# Altium project 50ohm-diff_converter.PrjPcb (part 1 of 2)
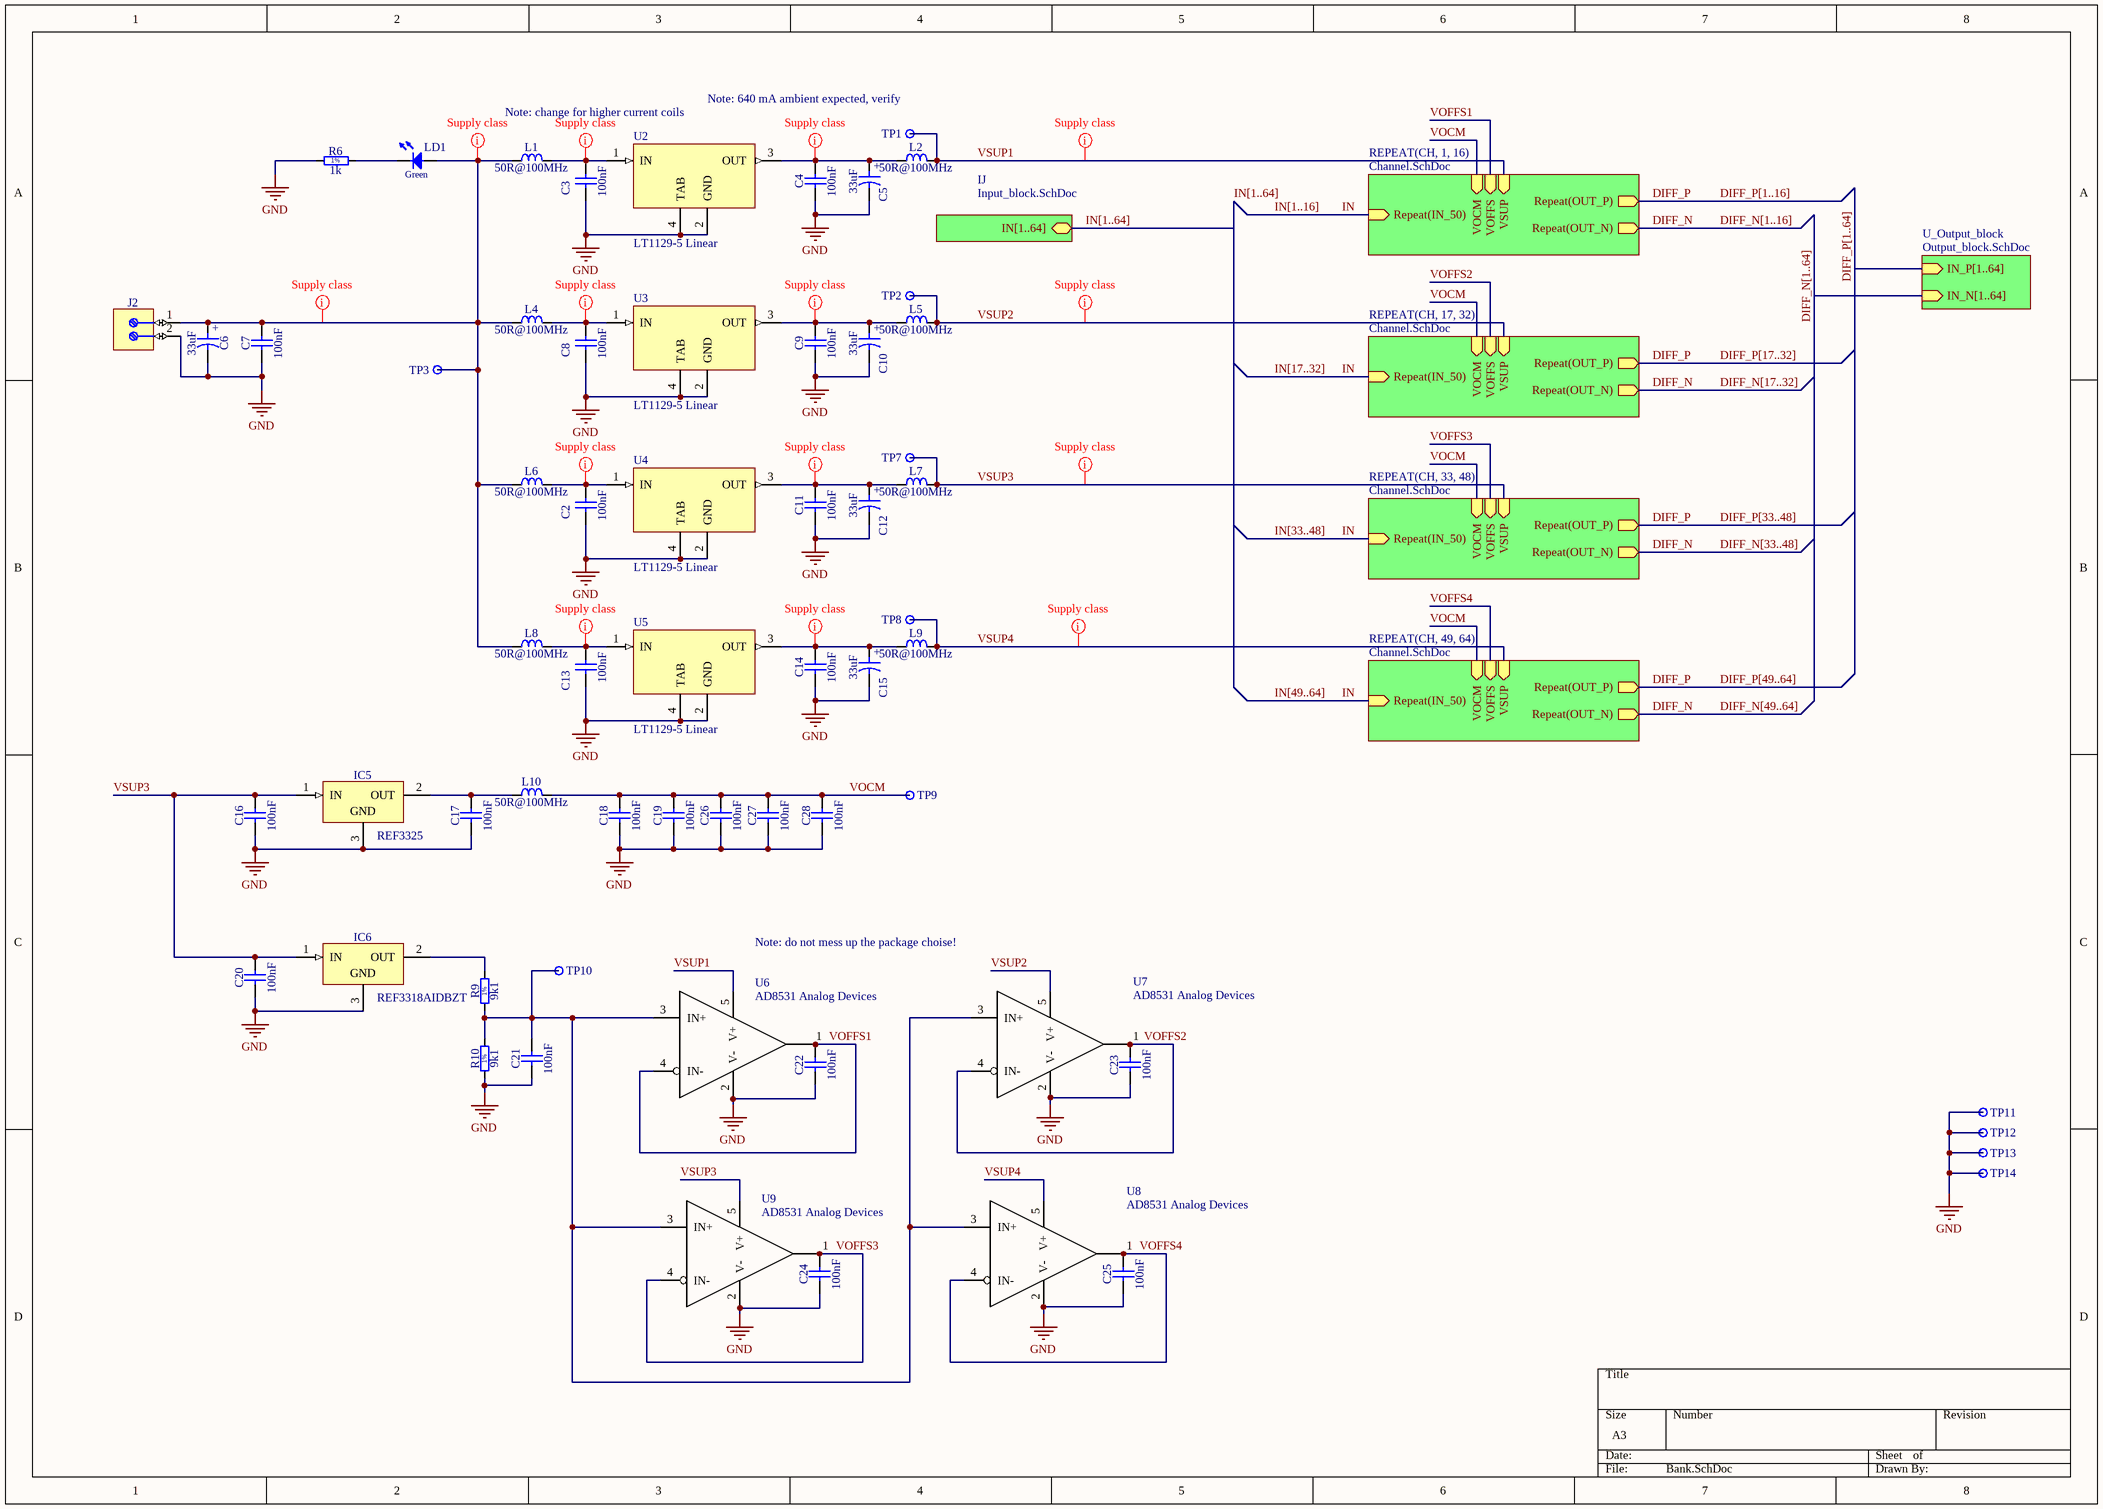
[diagram p0: Bank.SchDoc]
4 sheets, 769 parts. Net scope: hierarchical (ports join the sheet entries above them; power ports are global).
Board file: PCB.PcbDoc
Sheets:
  Bank.SchDoc
    CH1 = Channel.SchDoc
    CH2 = Channel.SchDoc
    CH3 = Channel.SchDoc
    CH4 = Channel.SchDoc
    CH5 = Channel.SchDoc
    CH6 = Channel.SchDoc
    CH7 = Channel.SchDoc
    CH8 = Channel.SchDoc
    CH9 = Channel.SchDoc
    CH10 = Channel.SchDoc
    CH11 = Channel.SchDoc
    CH12 = Channel.SchDoc
    CH13 = Channel.SchDoc
    CH14 = Channel.SchDoc
    CH15 = Channel.SchDoc
    CH16 = Channel.SchDoc
    IJ = Input_block.SchDoc
    CH17 = Channel.SchDoc
    CH18 = Channel.SchDoc
    CH19 = Channel.SchDoc
    CH20 = Channel.SchDoc
    CH21 = Channel.SchDoc
    CH22 = Channel.SchDoc
    CH23 = Channel.SchDoc
    CH24 = Channel.SchDoc
    CH25 = Channel.SchDoc
    CH26 = Channel.SchDoc
    CH27 = Channel.SchDoc
    CH28 = Channel.SchDoc
    CH29 = Channel.SchDoc
    CH30 = Channel.SchDoc
    CH31 = Channel.SchDoc
    CH32 = Channel.SchDoc
    U_Output_block = Output_block.SchDoc
    CH33 = Channel.SchDoc
    CH34 = Channel.SchDoc
    CH35 = Channel.SchDoc
    CH36 = Channel.SchDoc
    CH37 = Channel.SchDoc
    CH38 = Channel.SchDoc
    CH39 = Channel.SchDoc
    CH40 = Channel.SchDoc
    CH41 = Channel.SchDoc
    CH42 = Channel.SchDoc
    CH43 = Channel.SchDoc
    CH44 = Channel.SchDoc
    CH45 = Channel.SchDoc
    CH46 = Channel.SchDoc
    CH47 = Channel.SchDoc
    CH48 = Channel.SchDoc
    CH49 = Channel.SchDoc
    CH50 = Channel.SchDoc
    CH51 = Channel.SchDoc
    CH52 = Channel.SchDoc
    CH53 = Channel.SchDoc
    CH54 = Channel.SchDoc
    CH55 = Channel.SchDoc
    CH56 = Channel.SchDoc
    CH57 = Channel.SchDoc
    CH58 = Channel.SchDoc
    CH59 = Channel.SchDoc
    CH60 = Channel.SchDoc
    CH61 = Channel.SchDoc
    CH62 = Channel.SchDoc
    CH63 = Channel.SchDoc
    CH64 = Channel.SchDoc

## Sheet Bank.SchDoc
size A3

### Parts
C2  100nF  [CAPC2012X135N]
C3  100nF  [CAPC2012X135N]
C4  100nF  [CAPC2012X135N]
C5  33uF  [CAPAE660X540N]
C6  33uF  [CAPAE660X540N]
C7  100nF  [CAPC2012X135N]
C8  100nF  [CAPC2012X135N]
C9  100nF  [CAPC2012X135N]
C10  33uF  [CAPAE660X540N]
C11  100nF  [CAPC2012X135N]
C12  33uF  [CAPAE660X540N]
C13  100nF  [CAPC2012X135N]
C14  100nF  [CAPC2012X135N]
C15  33uF  [CAPAE660X540N]
C16  100nF  [CAPC2012X135N]
C17  100nF  [CAPC2012X135N]
C18  100nF  [CAPC2012X135N]
C19  100nF  [CAPC2012X135N]
C20  100nF  [CAPC2012X135N]
C21  100nF  [CAPC2012X135N]
C22  100nF  [CAPC2012X135N]
C23  100nF  [CAPC2012X135N]
C24  100nF  [CAPC2012X135N]
C25  100nF  [CAPC2012X135N]
C26  100nF  [CAPC2012X135N]
C27  100nF  [CAPC2012X135N]
C28  100nF  [CAPC2012X135N]
IC5  REF3325  [SOT95P237X112-3N]
IC6  REF3318AIDBZT  [SOT95P237X112-3N]
J2  Terminal  [WIELAND_25.161.0253.0]  (value not drawn)
L1  50R@100MHz  [IND_MURATA_BLM31PG]
L2  50R@100MHz  [IND_MURATA_BLM31PG]
L4  50R@100MHz  [IND_MURATA_BLM31PG]
L5  50R@100MHz  [IND_MURATA_BLM31PG]
L6  50R@100MHz  [IND_MURATA_BLM31PG]
L7  50R@100MHz  [IND_MURATA_BLM31PG]
L8  50R@100MHz  [IND_MURATA_BLM31PG]
L9  50R@100MHz  [IND_MURATA_BLM31PG]
L10  50R@100MHz  [IND_MURATA_BLM31PG]
LD1  Green  [LED_OSRAM_LGR971]  (value not drawn)
R6  1k  [RESC2012X60N]
R9  9k1  [RESC2012X60N]
R10  9k1  [RESC2012X60N]
TP1  Test Point  [VERO_20-313145]  (value not drawn)
TP2  Test Point  [VERO_20-313145]  (value not drawn)
TP3  Test Point  [VERO_20-313145]  (value not drawn)
TP7  Test Point  [VERO_20-313145]  (value not drawn)
TP8  Test Point  [VERO_20-313145]  (value not drawn)
TP9  Test Point  [VERO_20-313145]  (value not drawn)
TP10  Test Point  [VERO_20-313145]  (value not drawn)
TP11  Test Point  [VERO_20-313145]  (value not drawn)
TP12  Test Point  [VERO_20-313145]  (value not drawn)
TP13  Test Point  [VERO_20-313145]  (value not drawn)
TP14  Test Point  [VERO_20-313145]  (value not drawn)
U2  LT1129-5 Linear  [SOT230P700X175-4N]
U3  LT1129-5 Linear  [SOT230P700X175-4N]
U4  LT1129-5 Linear  [SOT230P700X175-4N]
U5  LT1129-5 Linear  [SOT230P700X175-4N]
U6  AD8531 Analog Devices  [SOT95P285X145-5N]
U7  AD8531 Analog Devices  [SOT95P285X145-5N]
U8  AD8531 Analog Devices  [SOT95P285X145-5N]
U9  AD8531 Analog Devices  [SOT95P285X145-5N]

### Sub-sheets
IJ = Input_block.SchDoc: IN[1..64] (bidir)
REPEAT(CH, 1, 16) = Channel.SchDoc: Repeat(OUT_N) (out), Repeat(OUT_P) (out), VSUP (in), Repeat(IN_50) (in), VOFFS (in), VOCM (in)
REPEAT(CH, 17, 32) = Channel.SchDoc: Repeat(OUT_N) (out), Repeat(OUT_P) (out), VSUP (in), Repeat(IN_50) (in), VOCM (in), VOFFS (in)
REPEAT(CH, 33, 48) = Channel.SchDoc: Repeat(OUT_N) (out), Repeat(OUT_P) (out), VSUP (in), Repeat(IN_50) (in), VOCM (in), VOFFS (in)
REPEAT(CH, 49, 64) = Channel.SchDoc: Repeat(OUT_N) (out), Repeat(OUT_P) (out), VSUP (in), Repeat(IN_50) (in), VOCM (in), VOFFS (in)
U_Output_block = Output_block.SchDoc: IN_P[1..64] (in), IN_N[1..64] (in)

### Nets
GND: C2.1 C3.1 C4.1 C5.2 C6.2 C7.1 C8.1 C9.1 C10.2 C11.1 C12.2 C13.1 C14.1 C15.2 C16.1 C17.1 C18.1 C19.1 C20.1 C21.1 C22.1 C23.1 C24.1 C25.1 C26.1 C27.1 C28.1 IC5.3(GND) IC6.3(GND) J2.2 R6.1 R10.1 TP11.1 TP12.1 TP13.1 TP14.1 U2.2(GND) U2.4(TAB) U3.2(GND) U3.4(TAB) U4.2(GND) U4.4(TAB) U5.2(GND) U5.4(TAB) U6.2(V-) U7.2(V-) U8.2(V-) U9.2(V-)
DIFF_N: sheet REPEAT(CH, 1, 16)/Repeat(OUT_N), sheet REPEAT(CH, 17, 32)/Repeat(OUT_N), sheet REPEAT(CH, 33, 48)/Repeat(OUT_N), sheet REPEAT(CH, 49, 64)/Repeat(OUT_N)
DIFF_P: sheet REPEAT(CH, 1, 16)/Repeat(OUT_P), sheet REPEAT(CH, 17, 32)/Repeat(OUT_P), sheet REPEAT(CH, 33, 48)/Repeat(OUT_P), sheet REPEAT(CH, 49, 64)/Repeat(OUT_P)
IN: sheet REPEAT(CH, 1, 16)/Repeat(IN_50), sheet REPEAT(CH, 17, 32)/Repeat(IN_50), sheet REPEAT(CH, 33, 48)/Repeat(IN_50), sheet REPEAT(CH, 49, 64)/Repeat(IN_50)
VOCM: C18.2 C19.2 C26.2 C27.2 C28.2 L10.2 TP9.1 ; sheet REPEAT(CH, 1, 16)/VOCM, sheet REPEAT(CH, 17, 32)/VOCM, sheet REPEAT(CH, 33, 48)/VOCM, sheet REPEAT(CH, 49, 64)/VOCM
VOFFS1: C22.2 U6.1(OUT+) U6.4(IN-) ; sheet REPEAT(CH, 1, 16)/VOFFS
VOFFS2: C23.2 U7.1(OUT+) U7.4(IN-) ; sheet REPEAT(CH, 17, 32)/VOFFS
VOFFS3: C24.2 U9.1(OUT+) U9.4(IN-) ; sheet REPEAT(CH, 33, 48)/VOFFS
VOFFS4: C25.2 U8.1(OUT+) U8.4(IN-) ; sheet REPEAT(CH, 49, 64)/VOFFS
VSUP1: L2.2 TP1.1 U6.5(V+) ; sheet REPEAT(CH, 1, 16)/VSUP
VSUP2: L5.2 TP2.1 U7.5(V+) ; sheet REPEAT(CH, 17, 32)/VSUP
VSUP3: C16.2 C20.2 IC5.1(IN) IC6.1(IN) L7.2 TP7.1 U9.5(V+) ; sheet REPEAT(CH, 33, 48)/VSUP
VSUP4: L9.2 TP8.1 U8.5(V+) ; sheet REPEAT(CH, 49, 64)/VSUP
NetC2_2: C2.2 L6.2 U4.1(IN)
NetC3_2: C3.2 L1.2 U2.1(IN)
NetC4_2: C4.2 C5.1 L2.1 U2.3(OUT)
NetC6_1: C6.1 C7.2 J2.1 L1.1 L4.1 L6.1 L8.1 LD1.2(A) TP3.1
NetC8_2: C8.2 L4.2 U3.1(IN)
NetC9_2: C9.2 C10.1 L5.1 U3.3(OUT)
NetC11_2: C11.2 C12.1 L7.1 U4.3(OUT)
NetC13_2: C13.2 L8.2 U5.1(IN)
NetC14_2: C14.2 C15.1 L9.1 U5.3(OUT)
NetC17_2: C17.2 IC5.2(OUT) L10.1
NetC21_2: C21.2 R9.1 R10.2 TP10.1 U6.3(IN+) U7.3(IN+) U8.3(IN+) U9.3(IN+)
NetIC6_2: IC6.2(OUT) R9.2
NetLD1_1: LD1.1(C) R6.2

### Buses and harness runs
bus DIFF_N[1..16]
bus DIFF_N[1..64] = sheet U_Output_block/IN_N[1..64]
bus DIFF_N[17..32]
bus DIFF_N[33..48]
bus DIFF_N[49..64]
bus DIFF_P[1..16]
bus DIFF_P[1..64] = sheet U_Output_block/IN_P[1..64]
bus DIFF_P[17..32]
bus DIFF_P[33..48]
bus DIFF_P[49..64]
bus IN[1..16]
bus IN[1..64] = sheet IJ/IN[1..64]
bus IN[17..32]
bus IN[33..48]
bus IN[49..64]

### Layout directives
net class Supply: NetC2_2, NetC3_2, NetC4_2, NetC6_1, NetC8_2, NetC9_2, NetC11_2, NetC13_2, NetC14_2, VSUP1, VSUP2, VSUP3, VSUP4

### Notes on the sheet
- (near TP1) Note: 640 mA ambient expected, verify
- Note: change for higher current coils
- Note: do not mess up the package choise!
- (in symbol CAE660-540_33UF_25V_20%) +
- (in symbol R0805_1K_1%_0.125W_100PPM) 1%
- (in symbol R0805_9K1_1%_0.125W_100PPM) 1%

### Library data of the parts
C2-C4 C7-C9 C11 C13 C14 C16-C28 = CC0805_100NF_50V_10%_X7R: Non-polarised capacitor; Part Description: SMD Multilayer Chip Ceramic Capacitor; Manufacturer: GENERIC; Manufacturer1 Part Number: C2012X7R1H104K085AA; Voltage: 50V; TC: X7R; Tolerance: ±10%; Part Number: CC0805_100NF_50V_10%_X7R; Component Kind: Standard; Component Type: Standard; Pin Count: 2; Value: 100nF; Status: Preferred; Manufacturer Part Number: CC0805_100NF_50V_10%_X7R; Case: 0805; Mounted: Yes; Socket: No; SMD: Yes; Sense: No; Manufacturer1 Example: TDK; Manufacturer1 ComponentHeight: 1mm; HelpURL: \\cern.ch\dfs\Applications\Altium\Datasheets\CC0805_X7R_TDK_C.pdf; Author: CERN DEM JLC; CreateDate: 03.12.2007; LatestRevisionDate: 22.04.2015
C5 C6 C10 C12 C15 = CAE660-540_33UF_25V_20%: Polarised capacitor; Part Description: Aluminum Electrolytic SMT Capacitor; Manufacturer: PANASONIC; Manufacturer Part Number: EEEFK1E330AP; Voltage: 25V; Tolerance: ±20%; Part Number: CAE660-540_33UF_25V_20%; Component Kind: Standard; Component Type: Standard; Pin Count: 2; Value: 33uF; Status: Not Recommended; Case: D; Mounted: Yes; Socket: No; SMD: Yes; Sense: No; ComponentHeight: 5.8mm; HelpURL: \\cern.ch\dfs\Applications\Altium\Datasheets\CAE_PANASONIC_FK.pdf; Author: CERN DEM JLC; CreateDate: 03.12.2007; LatestRevisionDate: 05.11.2014
IC5 IC6 = REF3318AIDBZT: 3-Terminal Regulator 1=IN 2=OUT 3=GND; Part Description: 1.8V, 30ppm/°C Drift, 3.9uA, Voltage Reference; Manufacturer: TEXAS INSTRUMENTS; PressFit: No; Bonding: No; Component Kind: Standard; Component Type: Standard; PackageDescription: SOT, 0.95mm, pitch; 3 pin,1.30mm W X 2.92mm L X 1.12mm H body, IPC Medium Density; Pin Count: 3; Case: SOT23; Mounted: Yes; Socket: No; SMD: Yes; Sense: No; ComponentHeight: 1.12mm; HelpURL: \\cern.ch\dfs\Applications\Altium\Datasheets\REF3318AIDBZT.pdf; Author: CERN DEM JLC; CreateDate: 20.06.2011; LatestRevisionDate: 20.06.2011
  IC5: Part Number: REF3325; Device: REF3325; Manufacturer Part Number: REF3325
  IC6: Part Number: REF3318AIDBZT; Device: REF3318AIDBZT; Manufacturer Part Number: REF3318AIDBZT
J2 = WIELAND_25.161.0253.0: Terminal Block, 2 Positions, Screw Connection; Part Description: 16A 250VAC 2 Way PCB Terminal Block, Pitch 5mm, Screw Connection, Wire Size Max: 2.5mm²; PressFit: No; Part Number: WIELAND_25.161.0253.0; Component Kind: Standard; Component Type: Standard; Pin Count: 3; Family: Terminal; Mounted: Yes; Socket: No; SMD: No; Sense: No; Status: None; Manufacturer: WIELAND; Manufacturer Part Number: 25.161.0253.0; ComponentHeight: 15mm; HelpURL: \\cern.ch\dfs\Applications\Altium\Datasheets\WIELAND_25.161.0253.0.pdf; Author: CERN DEM JLC; CreateDate: 03.06.2009; LatestRevisionDate: 03.06.2009
L1 L2 L4-L10 = IND1206_MURATA_BLM31PG500SN1: Inductor; Part Description: SMD EMIFIL Chip Ferrite Bead; Manufacturer: MURATA; Power: 3.5A; Resistance: 0.015R; Part Number: IND1206_MURATA_BLM31PG500SN1; Component Kind: Standard; Component Type: Standard; Pin Count: 2; Value: 50R@100MHz; Status: None; Manufacturer Part Number: BLM31PG500SN1; Case: 1206; Mounted: Yes; Socket: No; SMD: Yes; Sense: No; ComponentHeight: 1.3mm; HelpURL: \\cern.ch\dfs\Applications\Altium\Datasheets\IND1206_MURATA_BLM31P.pdf; Author: CERN DEM JLC; CreateDate: 05.12.2013; LatestRevisionDate: 05.12.2013
LD1 = LED_OSRAM_LGR971: LED Green 1C 2A; Part Description: Surface Mount Green LED (0805 Case); Manufacturer: OSRAM; Manufacturer Part Number: LGR971; PressFit: No; Bonding: No; Part Number: LED_OSRAM_LGR971; Component Kind: Standard; Component Type: Standard; Color: Green; PackageDescription: Green Chip LED, 2-Leads, Body 2.0x1.25mm, IPC Medium Density; Pin Count: 2; Case: 0805; Mounted: Yes; Socket: No; SMD: Yes; Sense: No; ComponentHeight: 0.9mm; HelpURL: \\cern.ch\dfs\Applications\Altium\Datasheets\LED_OSRAM_LGR971.pdf; Author: CERN DEM JLC; CreateDate: 28.01.2009; LatestRevisionDate: 17.03.2010
R6 = R0805_1K_1%_0.125W_100PPM: Resistor - 1%; Part Description: General Purpose Thick Film Chip Resistor; Manufacturer: GENERIC; Manufacturer1 Part Number: NRC10F1001TRF; Power: 0.125W; TC: ±100ppm/°C; PressFit: No; Part Number: R0805_1K_1%_0.125W_100PPM; Component Kind: Standard; Component Type: Standard; Pin Count: 2; Value: 1k; Status: Preferred; Tolerance: ±1%; Manufacturer Part Number: R0805_1K_1%_0.125W_100PPM; Case: 0805; Mounted: Yes; Sense: No; Socket: No; SMD: Yes; Manufacturer1 Example: NIC COMPONENT; Manufacturer1 ComponentHeight: 0.6mm; HelpURL: \\cern.ch\dfs\Applications\Altium\Datasheets\R0805_NIC_NRC.pdf; Author: CERN DEM JLC; CreateDate: 03.12.2007; LatestRevisionDate: 13.03.2008
R9 R10 = R0805_9K1_1%_0.125W_100PPM: Resistor - 1%; Part Description: General Purpose Thick Film Chip Resistor; Manufacturer: GENERIC; Manufacturer1 Part Number: NRC10F9101TRF; Power: 0.125W; TC: ±100ppm/°C; PressFit: No; Part Number: R0805_9K1_1%_0.125W_100PPM; Component Kind: Standard; Component Type: Standard; Pin Count: 2; Value: 9k1; Status: Preferred; Tolerance: ±1%; Manufacturer Part Number: R0805_9K1_1%_0.125W_100PPM; Case: 0805; Mounted: Yes; Sense: No; Socket: No; SMD: Yes; Manufacturer1 Example: NIC COMPONENT; Manufacturer1 ComponentHeight: 0.6mm; HelpURL: \\cern.ch\dfs\Applications\Altium\Datasheets\R0805_NIC_NRC.pdf; Author: CERN DEM JLC; CreateDate: 03.12.2007; LatestRevisionDate: 13.03.2008
TP1-TP3 TP7-TP14 = VERO_20-313145: Part Description: Black Bead PCB Terminal Test Pin for 2.4mm PCB Thickness (1.32mm Hole); Manufacturer: VERO TECHNOLOGIES; PressFit: No; Part Number: VERO_20-313145; Component Kind: Standard; Component Type: Standard; Pin Count: 1; Family: Test Point; Mounted: Yes; Socket: No; SMD: No; Sense: No; Status: None; Manufacturer Part Number: 20-313145; ComponentHeight: 5.3mm; HelpURL: \\cern.ch\dfs\Applications\Altium\Datasheets\VERO_20-313145.pdf; Author: CERN DEM JLC; CreateDate: 15.07.2013; LatestRevisionDate: 15.07.2013
U2-U5 = LT1129-5: Name: LT1129-5; Manufacturer: Linear
U6-U9 = AD8531: Manufacturer: Analog Devices; Name: AD8531

## Sheet Channel.SchDoc
size A4
Used 64 times, as channels CH1, CH2, CH3, CH4, CH5, CH6, CH7, CH8, CH9, CH10, CH11, CH12, CH13, CH14, CH15, CH16, CH17, CH18, CH19, CH20, CH21, CH22, CH23, CH24, CH25, CH26, CH27, CH28, CH29, CH30, CH31, CH32, CH33, CH34, CH35, CH36, CH37, CH38, CH39, CH40, CH41, CH42, CH43, CH44, CH45, CH46, CH47, CH48, CH49, CH50, CH51, CH52, CH53, CH54, CH55, CH56, CH57, CH58, CH59, CH60, CH61, CH62, CH63, CH64. Parts and nets are listed once, with the designators drawn on the sheet.
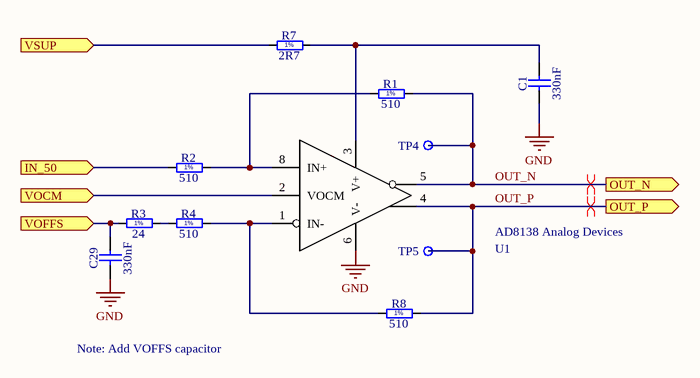
[diagram p1: Channel.SchDoc]

### Parts
C1  330nF  [CAPC2012X135N]
C29  330nF  [CAPC2012X135N]
R1  510  [RESC2012X60N]
R2  510  [RESC2012X60N]
R3  24  [RESC2012X60N]
R4  510  [RESC2012X60N]
R7  2R7  [RESC2012X60N]
R8  510  [RESC2012X60N]
TP4  Test Point  [Testpoint]  (value not drawn)
TP5  Test Point  [Testpoint]  (value not drawn)
U1  AD8138 Analog Devices  [SOIC127P600X175-8N]

### Ports
IN_50 (in), OUT_N (out), OUT_P (out), VOCM (in), VOFFS (in), VSUP (in)

### Nets
GND: C1.1 C29.1 U1.6(V-)
IN_50: R2.1 ; port IN_50
OUT_N: R1.2 TP4.1 U1.5(OUT-) ; port OUT_N
OUT_P: R8.2 TP5.1 U1.4(OUT+) ; port OUT_P
VOCM: U1.2(VOCM) ; port VOCM
VOFFS: C29.2 R3.1 ; port VOFFS
VSUP: R7.1 ; port VSUP
NetC1_2: C1.2 R7.2 U1.3(V+)
NetR1_1: R1.1 R2.2 U1.8(IN+)
NetR3_2: R3.2 R4.1
NetR4_2: R4.2 R8.1 U1.1(IN-)

### Channels
CH1: designators end in _CH1; ports IN_50=IN1 OUT_N=DIFF_N1 OUT_P=DIFF_P1 VOCM=VOCM VOFFS=VOFFS1 VSUP=VSUP1
CH2: designators end in _CH2; ports IN_50=IN2 OUT_N=DIFF_N2 OUT_P=DIFF_P2 VOCM=VOCM VOFFS=VOFFS1 VSUP=VSUP1
CH3: designators end in _CH3; ports IN_50=IN3 OUT_N=DIFF_N3 OUT_P=DIFF_P3 VOCM=VOCM VOFFS=VOFFS1 VSUP=VSUP1
CH4: designators end in _CH4; ports IN_50=IN4 OUT_N=DIFF_N4 OUT_P=DIFF_P4 VOCM=VOCM VOFFS=VOFFS1 VSUP=VSUP1
CH5: designators end in _CH5; ports IN_50=IN5 OUT_N=DIFF_N5 OUT_P=DIFF_P5 VOCM=VOCM VOFFS=VOFFS1 VSUP=VSUP1
CH6: designators end in _CH6; ports IN_50=IN6 OUT_N=DIFF_N6 OUT_P=DIFF_P6 VOCM=VOCM VOFFS=VOFFS1 VSUP=VSUP1
CH7: designators end in _CH7; ports IN_50=IN7 OUT_N=DIFF_N7 OUT_P=DIFF_P7 VOCM=VOCM VOFFS=VOFFS1 VSUP=VSUP1
CH8: designators end in _CH8; ports IN_50=IN8 OUT_N=DIFF_N8 OUT_P=DIFF_P8 VOCM=VOCM VOFFS=VOFFS1 VSUP=VSUP1
CH9: designators end in _CH9; ports IN_50=IN9 OUT_N=DIFF_N9 OUT_P=DIFF_P9 VOCM=VOCM VOFFS=VOFFS1 VSUP=VSUP1
CH10: designators end in _CH10; ports IN_50=IN10 OUT_N=DIFF_N10 OUT_P=DIFF_P10 VOCM=VOCM VOFFS=VOFFS1 VSUP=VSUP1
CH11: designators end in _CH11; ports IN_50=IN11 OUT_N=DIFF_N11 OUT_P=DIFF_P11 VOCM=VOCM VOFFS=VOFFS1 VSUP=VSUP1
CH12: designators end in _CH12; ports IN_50=IN12 OUT_N=DIFF_N12 OUT_P=DIFF_P12 VOCM=VOCM VOFFS=VOFFS1 VSUP=VSUP1
CH13: designators end in _CH13; ports IN_50=IN13 OUT_N=DIFF_N13 OUT_P=DIFF_P13 VOCM=VOCM VOFFS=VOFFS1 VSUP=VSUP1
CH14: designators end in _CH14; ports IN_50=IN14 OUT_N=DIFF_N14 OUT_P=DIFF_P14 VOCM=VOCM VOFFS=VOFFS1 VSUP=VSUP1
CH15: designators end in _CH15; ports IN_50=IN15 OUT_N=DIFF_N15 OUT_P=DIFF_P15 VOCM=VOCM VOFFS=VOFFS1 VSUP=VSUP1
CH16: designators end in _CH16; ports IN_50=IN16 OUT_N=DIFF_N16 OUT_P=DIFF_P16 VOCM=VOCM VOFFS=VOFFS1 VSUP=VSUP1
CH17: designators end in _CH17; ports IN_50=IN17 OUT_N=DIFF_N17 OUT_P=DIFF_P17 VOCM=VOCM VOFFS=VOFFS2 VSUP=VSUP2
CH18: designators end in _CH18; ports IN_50=IN18 OUT_N=DIFF_N18 OUT_P=DIFF_P18 VOCM=VOCM VOFFS=VOFFS2 VSUP=VSUP2
CH19: designators end in _CH19; ports IN_50=IN19 OUT_N=DIFF_N19 OUT_P=DIFF_P19 VOCM=VOCM VOFFS=VOFFS2 VSUP=VSUP2
CH20: designators end in _CH20; ports IN_50=IN20 OUT_N=DIFF_N20 OUT_P=DIFF_P20 VOCM=VOCM VOFFS=VOFFS2 VSUP=VSUP2
CH21: designators end in _CH21; ports IN_50=IN21 OUT_N=DIFF_N21 OUT_P=DIFF_P21 VOCM=VOCM VOFFS=VOFFS2 VSUP=VSUP2
CH22: designators end in _CH22; ports IN_50=IN22 OUT_N=DIFF_N22 OUT_P=DIFF_P22 VOCM=VOCM VOFFS=VOFFS2 VSUP=VSUP2
CH23: designators end in _CH23; ports IN_50=IN23 OUT_N=DIFF_N23 OUT_P=DIFF_P23 VOCM=VOCM VOFFS=VOFFS2 VSUP=VSUP2
CH24: designators end in _CH24; ports IN_50=IN24 OUT_N=DIFF_N24 OUT_P=DIFF_P24 VOCM=VOCM VOFFS=VOFFS2 VSUP=VSUP2
CH25: designators end in _CH25; ports IN_50=IN25 OUT_N=DIFF_N25 OUT_P=DIFF_P25 VOCM=VOCM VOFFS=VOFFS2 VSUP=VSUP2
CH26: designators end in _CH26; ports IN_50=IN26 OUT_N=DIFF_N26 OUT_P=DIFF_P26 VOCM=VOCM VOFFS=VOFFS2 VSUP=VSUP2
CH27: designators end in _CH27; ports IN_50=IN27 OUT_N=DIFF_N27 OUT_P=DIFF_P27 VOCM=VOCM VOFFS=VOFFS2 VSUP=VSUP2
CH28: designators end in _CH28; ports IN_50=IN28 OUT_N=DIFF_N28 OUT_P=DIFF_P28 VOCM=VOCM VOFFS=VOFFS2 VSUP=VSUP2
CH29: designators end in _CH29; ports IN_50=IN29 OUT_N=DIFF_N29 OUT_P=DIFF_P29 VOCM=VOCM VOFFS=VOFFS2 VSUP=VSUP2
CH30: designators end in _CH30; ports IN_50=IN30 OUT_N=DIFF_N30 OUT_P=DIFF_P30 VOCM=VOCM VOFFS=VOFFS2 VSUP=VSUP2
CH31: designators end in _CH31; ports IN_50=IN31 OUT_N=DIFF_N31 OUT_P=DIFF_P31 VOCM=VOCM VOFFS=VOFFS2 VSUP=VSUP2
CH32: designators end in _CH32; ports IN_50=IN32 OUT_N=DIFF_N32 OUT_P=DIFF_P32 VOCM=VOCM VOFFS=VOFFS2 VSUP=VSUP2
CH33: designators end in _CH33; ports IN_50=IN33 OUT_N=DIFF_N33 OUT_P=DIFF_P33 VOCM=VOCM VOFFS=VOFFS3 VSUP=VSUP3
CH34: designators end in _CH34; ports IN_50=IN34 OUT_N=DIFF_N34 OUT_P=DIFF_P34 VOCM=VOCM VOFFS=VOFFS3 VSUP=VSUP3
CH35: designators end in _CH35; ports IN_50=IN35 OUT_N=DIFF_N35 OUT_P=DIFF_P35 VOCM=VOCM VOFFS=VOFFS3 VSUP=VSUP3
CH36: designators end in _CH36; ports IN_50=IN36 OUT_N=DIFF_N36 OUT_P=DIFF_P36 VOCM=VOCM VOFFS=VOFFS3 VSUP=VSUP3
CH37: designators end in _CH37; ports IN_50=IN37 OUT_N=DIFF_N37 OUT_P=DIFF_P37 VOCM=VOCM VOFFS=VOFFS3 VSUP=VSUP3
CH38: designators end in _CH38; ports IN_50=IN38 OUT_N=DIFF_N38 OUT_P=DIFF_P38 VOCM=VOCM VOFFS=VOFFS3 VSUP=VSUP3
CH39: designators end in _CH39; ports IN_50=IN39 OUT_N=DIFF_N39 OUT_P=DIFF_P39 VOCM=VOCM VOFFS=VOFFS3 VSUP=VSUP3
CH40: designators end in _CH40; ports IN_50=IN40 OUT_N=DIFF_N40 OUT_P=DIFF_P40 VOCM=VOCM VOFFS=VOFFS3 VSUP=VSUP3
CH41: designators end in _CH41; ports IN_50=IN41 OUT_N=DIFF_N41 OUT_P=DIFF_P41 VOCM=VOCM VOFFS=VOFFS3 VSUP=VSUP3
CH42: designators end in _CH42; ports IN_50=IN42 OUT_N=DIFF_N42 OUT_P=DIFF_P42 VOCM=VOCM VOFFS=VOFFS3 VSUP=VSUP3
CH43: designators end in _CH43; ports IN_50=IN43 OUT_N=DIFF_N43 OUT_P=DIFF_P43 VOCM=VOCM VOFFS=VOFFS3 VSUP=VSUP3
CH44: designators end in _CH44; ports IN_50=IN44 OUT_N=DIFF_N44 OUT_P=DIFF_P44 VOCM=VOCM VOFFS=VOFFS3 VSUP=VSUP3
CH45: designators end in _CH45; ports IN_50=IN45 OUT_N=DIFF_N45 OUT_P=DIFF_P45 VOCM=VOCM VOFFS=VOFFS3 VSUP=VSUP3
CH46: designators end in _CH46; ports IN_50=IN46 OUT_N=DIFF_N46 OUT_P=DIFF_P46 VOCM=VOCM VOFFS=VOFFS3 VSUP=VSUP3
CH47: designators end in _CH47; ports IN_50=IN47 OUT_N=DIFF_N47 OUT_P=DIFF_P47 VOCM=VOCM VOFFS=VOFFS3 VSUP=VSUP3
CH48: designators end in _CH48; ports IN_50=IN48 OUT_N=DIFF_N48 OUT_P=DIFF_P48 VOCM=VOCM VOFFS=VOFFS3 VSUP=VSUP3
CH49: designators end in _CH49; ports IN_50=IN49 OUT_N=DIFF_N49 OUT_P=DIFF_P49 VOCM=VOCM VOFFS=VOFFS4 VSUP=VSUP4
CH50: designators end in _CH50; ports IN_50=IN50 OUT_N=DIFF_N50 OUT_P=DIFF_P50 VOCM=VOCM VOFFS=VOFFS4 VSUP=VSUP4
CH51: designators end in _CH51; ports IN_50=IN51 OUT_N=DIFF_N51 OUT_P=DIFF_P51 VOCM=VOCM VOFFS=VOFFS4 VSUP=VSUP4
CH52: designators end in _CH52; ports IN_50=IN52 OUT_N=DIFF_N52 OUT_P=DIFF_P52 VOCM=VOCM VOFFS=VOFFS4 VSUP=VSUP4
CH53: designators end in _CH53; ports IN_50=IN53 OUT_N=DIFF_N53 OUT_P=DIFF_P53 VOCM=VOCM VOFFS=VOFFS4 VSUP=VSUP4
CH54: designators end in _CH54; ports IN_50=IN54 OUT_N=DIFF_N54 OUT_P=DIFF_P54 VOCM=VOCM VOFFS=VOFFS4 VSUP=VSUP4
CH55: designators end in _CH55; ports IN_50=IN55 OUT_N=DIFF_N55 OUT_P=DIFF_P55 VOCM=VOCM VOFFS=VOFFS4 VSUP=VSUP4
CH56: designators end in _CH56; ports IN_50=IN56 OUT_N=DIFF_N56 OUT_P=DIFF_P56 VOCM=VOCM VOFFS=VOFFS4 VSUP=VSUP4
CH57: designators end in _CH57; ports IN_50=IN57 OUT_N=DIFF_N57 OUT_P=DIFF_P57 VOCM=VOCM VOFFS=VOFFS4 VSUP=VSUP4
CH58: designators end in _CH58; ports IN_50=IN58 OUT_N=DIFF_N58 OUT_P=DIFF_P58 VOCM=VOCM VOFFS=VOFFS4 VSUP=VSUP4
CH59: designators end in _CH59; ports IN_50=IN59 OUT_N=DIFF_N59 OUT_P=DIFF_P59 VOCM=VOCM VOFFS=VOFFS4 VSUP=VSUP4
CH60: designators end in _CH60; ports IN_50=IN60 OUT_N=DIFF_N60 OUT_P=DIFF_P60 VOCM=VOCM VOFFS=VOFFS4 VSUP=VSUP4
CH61: designators end in _CH61; ports IN_50=IN61 OUT_N=DIFF_N61 OUT_P=DIFF_P61 VOCM=VOCM VOFFS=VOFFS4 VSUP=VSUP4
CH62: designators end in _CH62; ports IN_50=IN62 OUT_N=DIFF_N62 OUT_P=DIFF_P62 VOCM=VOCM VOFFS=VOFFS4 VSUP=VSUP4
CH63: designators end in _CH63; ports IN_50=IN63 OUT_N=DIFF_N63 OUT_P=DIFF_P63 VOCM=VOCM VOFFS=VOFFS4 VSUP=VSUP4
CH64: designators end in _CH64; ports IN_50=IN64 OUT_N=DIFF_N64 OUT_P=DIFF_P64 VOCM=VOCM VOFFS=VOFFS4 VSUP=VSUP4

### Layout directives
differential pair: DIFF_N1, DIFF_P1

### Notes on the sheet
- Note: Add VOFFS capacitor
- (in symbol R0805_2R7_1%_0.125W_200PPM) 1%
- (in symbol R0805_24R_1%_0.125W_100PPM) 1%
- (in symbol R0805_510R_1%_0.125W_100PPM) 1%

### Library data of the parts
C1 C29 = CC0805_330NF_16V_10%_X7R: Non-polarised capacitor; Part Description: SMD Multilayer Chip Ceramic Capacitor; Manufacturer: GENERIC; Manufacturer1 Part Number: CC0805KKX7R7BB334; Voltage: 16V; TC: X7R; Tolerance: ±10%; Part Number: CC0805_330NF_16V_10%_X7R; Component Kind: Standard; Component Type: Standard; Pin Count: 2; Value: 330nF; Status: Preferred; Manufacturer Part Number: CC0805_330NF_16V_10%_X7R; Case: 0805; Mounted: Yes; Socket: No; SMD: Yes; Sense: No; Manufacturer1 Example: YAGEO; Manufacturer1 ComponentHeight: 1.45mm; HelpURL: \\cern.ch\dfs\Applications\Altium\Datasheets\CC0805_X7R_YAGEO_HIGH CAPACITANCE_MAX50V.pdf; Author: CERN DEM JLC; CreateDate: 03.12.2007; LatestRevisionDate: 21.04.2015
R1 R2 R4 R8 = R0805_510R_1%_0.125W_100PPM: Resistor - 1%; Part Description: General Purpose Thick Film Chip Resistor; Manufacturer: GENERIC; Manufacturer1 Part Number: NRC10F5100TRF; Power: 0.125W; TC: ±100ppm/°C; PressFit: No; Part Number: R0805_510R_1%_0.125W_100PPM; Component Kind: Standard; Component Type: Standard; Pin Count: 2; Value: 510; Status: Preferred; Tolerance: ±1%; Manufacturer Part Number: R0805_510R_1%_0.125W_100PPM; Case: 0805; Mounted: Yes; Sense: No; Socket: No; SMD: Yes; Manufacturer1 Example: NIC COMPONENT; Manufacturer1 ComponentHeight: 0.6mm; HelpURL: \\cern.ch\dfs\Applications\Altium\Datasheets\R0805_NIC_NRC.pdf; Author: CERN DEM JLC; CreateDate: 03.12.2007; LatestRevisionDate: 13.03.2008
R3 = R0805_24R_1%_0.125W_100PPM: Resistor - 1%; Part Description: General Purpose Thick Film Chip Resistor; Manufacturer: GENERIC; Manufacturer1 Part Number: NRC10F24R0TRF; Power: 0.125W; TC: ±100ppm/°C; PressFit: No; Part Number: R0805_24R_1%_0.125W_100PPM; Component Kind: Standard; Component Type: Standard; Pin Count: 2; Value: 24; Status: Preferred; Tolerance: ±1%; Manufacturer Part Number: R0805_24R_1%_0.125W_100PPM; Case: 0805; Mounted: Yes; Sense: No; Socket: No; SMD: Yes; Manufacturer1 Example: NIC COMPONENT; Manufacturer1 ComponentHeight: 0.6mm; HelpURL: \\cern.ch\dfs\Applications\Altium\Datasheets\R0805_NIC_NRC.pdf; Author: CERN DEM JLC; CreateDate: 03.12.2007; LatestRevisionDate: 13.03.2008
R7 = R0805_2R7_1%_0.125W_200PPM: Resistor - 1%; Part Description: General Purpose Thick Film Chip Resistor; Manufacturer: GENERIC; Manufacturer1 Part Number: 232273462708L or RC0805FR-072R7L; Power: 0.125W; TC: ±200ppm/°C; PressFit: No; Part Number: R0805_2R7_1%_0.125W_200PPM; Component Kind: Standard; Component Type: Standard; Pin Count: 2; Value: 2R7; Status: Preferred; Tolerance: ±1%; Manufacturer Part Number: R0805_2R7_1%_0.125W_200PPM; Case: 0805; Mounted: Yes; Sense: No; Socket: No; SMD: Yes; Manufacturer1 Example: YAGEO PHYCOMP; Manufacturer1 ComponentHeight: 0.65mm; HelpURL: \\cern.ch\dfs\Applications\Altium\Datasheets\R0805_Phycomp_RC0805.pdf; Author: CERN DEM JLC; CreateDate: 03.12.2007; LatestRevisionDate: 17.10.2012
TP4 TP5 = VERO_20-313145: as TP1 on sheet Bank; Part Number: VERO_20-313145; Component Kind: Standard; Component Type: Standard; Footprint: VERO_20-313145; Pin Count: 1; Family: Test Point; Mounted: Yes; Socket: No; SMD: No; Sense: No; Status: None; Manufacturer Part Number: 20-313145; ComponentHeight: 5.3mm; HelpURL: \\cern.ch\dfs\Applications\Altium\Datasheets\VERO_20-313145.pdf; Author: CERN DEM JLC; CreateDate: 15.07.2013; LatestRevisionDate: 15.07.2013
U1 = AD8138: Manufacturer: Analog Devices; Name: AD8138

## Sheet Input_block.SchDoc
size A4
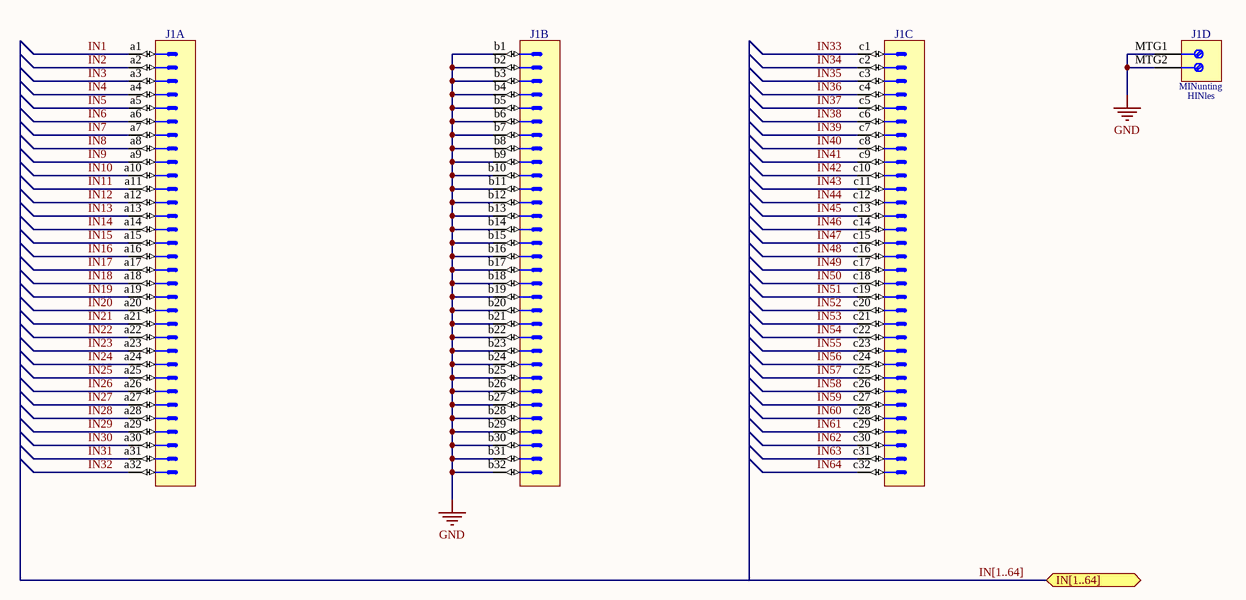
[diagram p2: Input_block.SchDoc]

### Parts
J1  DIN 41612 Type C  [HARTING_09 03 196 6921]  (value not drawn)  (parts A,B,C,D of 4)

### Ports
IN[1..64] (bidir)

### Nets
GND: J1.b1 J1.b2 J1.b3 J1.b4 J1.b5 J1.b6 J1.b7 J1.b8 J1.b9 J1.b10 J1.b11 J1.b12 J1.b13 J1.b14 J1.b15 J1.b16 J1.b17 J1.b18 J1.b19 J1.b20 J1.b21 J1.b22 J1.b23 J1.b24 J1.b25 J1.b26 J1.b27 J1.b28 J1.b29 J1.b30 J1.b31 J1.b32 J1.MTG1 J1.MTG2
IN1: J1.a1
IN2: J1.a2
IN3: J1.a3
IN4: J1.a4
IN5: J1.a5
IN6: J1.a6
IN7: J1.a7
IN8: J1.a8
IN9: J1.a9
IN10: J1.a10
IN11: J1.a11
IN12: J1.a12
IN13: J1.a13
IN14: J1.a14
IN15: J1.a15
IN16: J1.a16
IN17: J1.a17
IN18: J1.a18
IN19: J1.a19
IN20: J1.a20
IN21: J1.a21
IN22: J1.a22
IN23: J1.a23
IN24: J1.a24
IN25: J1.a25
IN26: J1.a26
IN27: J1.a27
IN28: J1.a28
IN29: J1.a29
IN30: J1.a30
IN31: J1.a31
IN32: J1.a32
IN33: J1.c1
IN34: J1.c2
IN35: J1.c3
IN36: J1.c4
IN37: J1.c5
IN38: J1.c6
IN39: J1.c7
IN40: J1.c8
IN41: J1.c9
IN42: J1.c10
IN43: J1.c11
IN44: J1.c12
IN45: J1.c13
IN46: J1.c14
IN47: J1.c15
IN48: J1.c16
IN49: J1.c17
IN50: J1.c18
IN51: J1.c19
IN52: J1.c20
IN53: J1.c21
IN54: J1.c22
IN55: J1.c23
IN56: J1.c24
IN57: J1.c25
IN58: J1.c26
IN59: J1.c27
IN60: J1.c28
IN61: J1.c29
IN62: J1.c30
IN63: J1.c31
IN64: J1.c32

### Buses and harness runs
bus IN[1..64] = port IN[1..64]

### Notes on the sheet
- (in symbol HARTING_09 03 196 6921, part D) MINunting; HINles

### Library data of the parts
J1 = HARTING_09 03 196 6921: Connector 96abc male (3x32); Part Description: DIN 41612, Type C, 96 Position, Rows a+b+c, Performance level 2, Right Angle Male Connector, Lead 3.0 mm, Pitch 2.54mm; PressFit: No; SCEM: 09.61.33.315.7; Part Number: HARTING_09 03 196 6921; Component Kind: Standard; Component Type: Standard; Pin Count: 98; Family: DIN 41612 Type C; Mounted: Yes; Socket: No; SMD: No; Sense: No; Status: None; Manufacturer: HARTING; Manufacturer Part Number: 09 03 196 6921; ComponentHeight: 11mm; HelpURL: \\cern.ch\dfs\Applications\Altium\Datasheets\HARTING_09 03 196 6921.pdf; Author: CERN DEM JMW; CreateDate: 25.02.2013; LatestRevisionDate: 25.02.2013

## Sheet Output_block.SchDoc
size A3
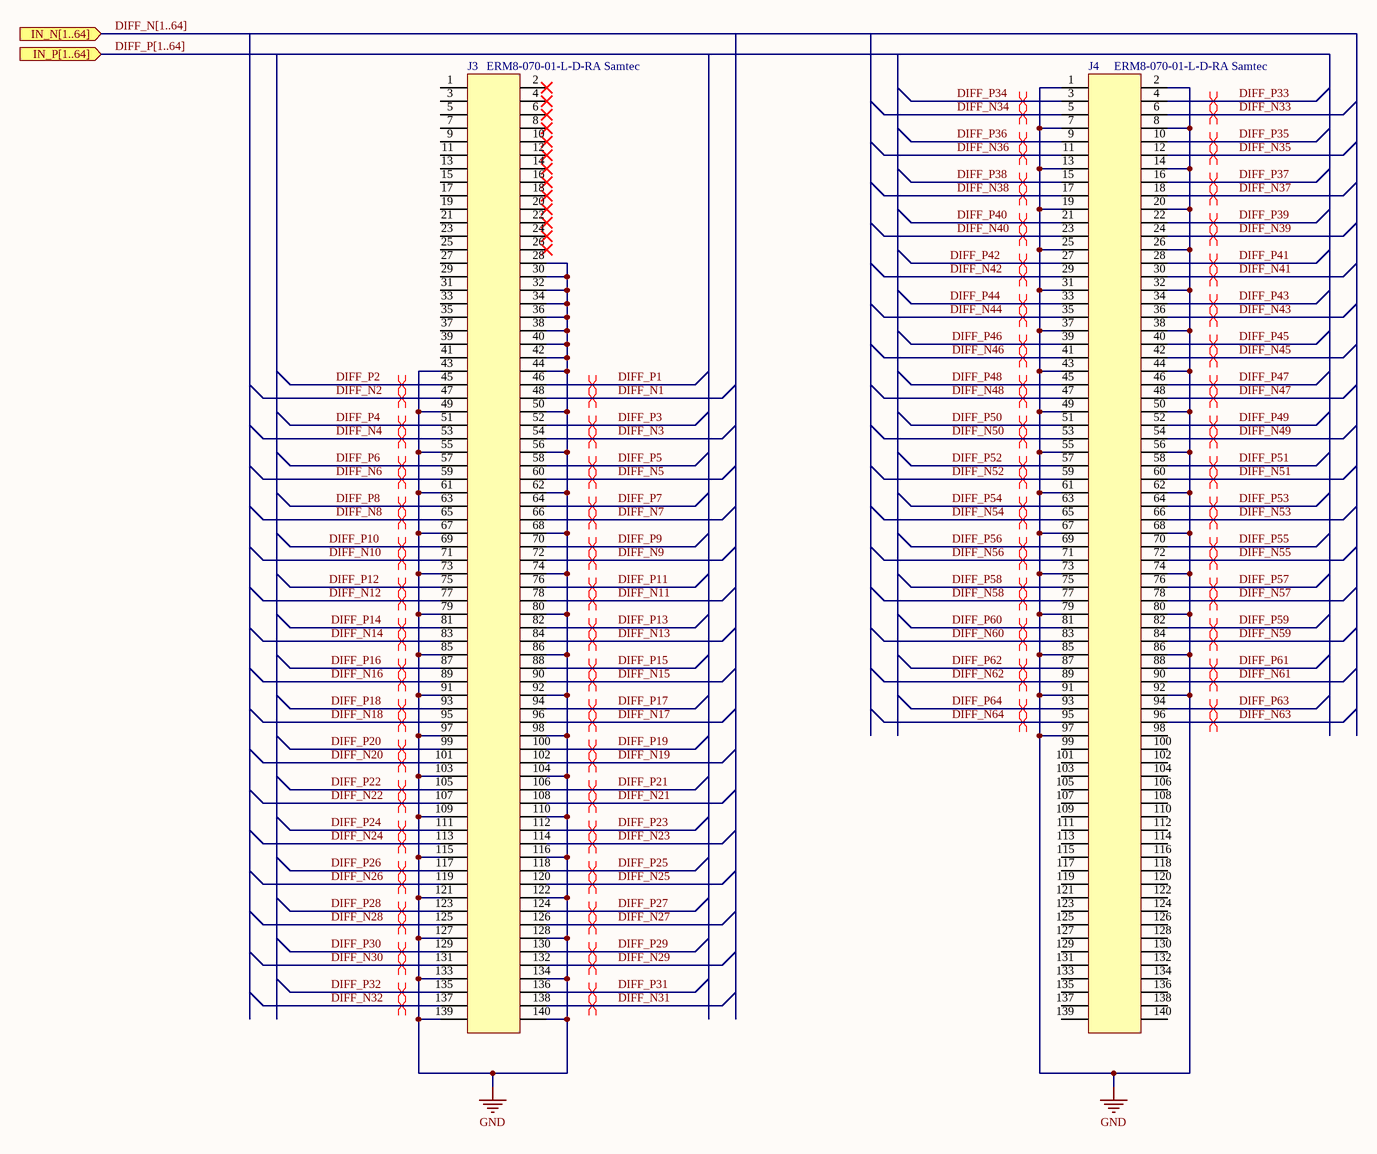
[diagram p3: Output_block.SchDoc]

### Parts
J3  ERM8-070-01-L-D-RA Samtec  [ERM8-070-01-L-D-RA]
J4  ERM8-070-01-L-D-RA Samtec  [ERM8-070-01-L-D-RA]

### Ports
IN_N[1..64] (in), IN_P[1..64] (in)

### Nets
GND: J3.28 J3.30 J3.32 J3.34 J3.36 J3.38 J3.40 J3.42 J3.43 J3.44 J3.49 J3.50 J3.55 J3.56 J3.61 J3.62 J3.67 J3.68 J3.73 J3.74 J3.79 J3.80 J3.85 J3.86 J3.91 J3.92 J3.97 J3.98 J3.103 J3.104 J3.109 J3.110 J3.115 J3.116 J3.121 J3.122 J3.127 J3.128 J3.133 J3.134 J3.139 J3.140 J4.1 J4.2 J4.7 J4.8 J4.13 J4.14 J4.19 J4.20 J4.25 J4.26 J4.31 J4.32 J4.37 J4.38 J4.43 J4.44 J4.49 J4.50 J4.55 J4.56 J4.61 J4.62 J4.67 J4.68 J4.73 J4.74 J4.79 J4.80 J4.85 J4.86 J4.91 J4.92 J4.97
DIFF_N1: J3.48
DIFF_N2: J3.47
DIFF_N3: J3.54
DIFF_N4: J3.53
DIFF_N5: J3.60
DIFF_N6: J3.59
DIFF_N7: J3.66
DIFF_N8: J3.65
DIFF_N9: J3.72
DIFF_N10: J3.71
DIFF_N11: J3.78
DIFF_N12: J3.77
DIFF_N13: J3.84
DIFF_N14: J3.83
DIFF_N15: J3.90
DIFF_N16: J3.89
DIFF_N17: J3.96
DIFF_N18: J3.95
DIFF_N19: J3.102
DIFF_N20: J3.101
DIFF_N21: J3.108
DIFF_N22: J3.107
DIFF_N23: J3.114
DIFF_N24: J3.113
DIFF_N25: J3.120
DIFF_N26: J3.119
DIFF_N27: J3.126
DIFF_N28: J3.125
DIFF_N29: J3.132
DIFF_N30: J3.131
DIFF_N31: J3.138
DIFF_N32: J3.137
DIFF_N33: J4.6
DIFF_N34: J4.5
DIFF_N35: J4.12
DIFF_N36: J4.11
DIFF_N37: J4.18
DIFF_N38: J4.17
DIFF_N39: J4.24
DIFF_N40: J4.23
DIFF_N41: J4.30
DIFF_N42: J4.29
DIFF_N43: J4.36
DIFF_N44: J4.35
DIFF_N45: J4.42
DIFF_N46: J4.41
DIFF_N47: J4.48
DIFF_N48: J4.47
DIFF_N49: J4.54
DIFF_N50: J4.53
DIFF_N51: J4.60
DIFF_N52: J4.59
DIFF_N53: J4.66
DIFF_N54: J4.65
DIFF_N55: J4.72
DIFF_N56: J4.71
DIFF_N57: J4.78
DIFF_N58: J4.77
DIFF_N59: J4.84
DIFF_N60: J4.83
DIFF_N61: J4.90
DIFF_N62: J4.89
DIFF_N63: J4.96
DIFF_N64: J4.95
DIFF_P1: J3.46
DIFF_P2: J3.45
DIFF_P3: J3.52
DIFF_P4: J3.51
DIFF_P5: J3.58
DIFF_P6: J3.57
DIFF_P7: J3.64
DIFF_P8: J3.63
DIFF_P9: J3.70
DIFF_P10: J3.69
DIFF_P11: J3.76
DIFF_P12: J3.75
DIFF_P13: J3.82
DIFF_P14: J3.81
DIFF_P15: J3.88
DIFF_P16: J3.87
DIFF_P17: J3.94
DIFF_P18: J3.93
DIFF_P19: J3.100
DIFF_P20: J3.99
DIFF_P21: J3.106
DIFF_P22: J3.105
DIFF_P23: J3.112
DIFF_P24: J3.111
DIFF_P25: J3.118
DIFF_P26: J3.117
DIFF_P27: J3.124
DIFF_P28: J3.123
DIFF_P29: J3.130
DIFF_P30: J3.129
DIFF_P31: J3.136
DIFF_P32: J3.135
DIFF_P33: J4.4
DIFF_P34: J4.3
DIFF_P35: J4.10
DIFF_P36: J4.9
DIFF_P37: J4.16
DIFF_P38: J4.15
DIFF_P39: J4.22
DIFF_P40: J4.21
DIFF_P41: J4.28
DIFF_P42: J4.27
DIFF_P43: J4.34
DIFF_P44: J4.33
DIFF_P45: J4.40
DIFF_P46: J4.39
DIFF_P47: J4.46
DIFF_P48: J4.45
DIFF_P49: J4.52
DIFF_P50: J4.51
DIFF_P51: J4.58
DIFF_P52: J4.57
DIFF_P53: J4.64
DIFF_P54: J4.63
DIFF_P55: J4.70
DIFF_P56: J4.69
DIFF_P57: J4.76
DIFF_P58: J4.75
DIFF_P59: J4.82
DIFF_P60: J4.81
DIFF_P61: J4.88
DIFF_P62: J4.87
DIFF_P63: J4.94
DIFF_P64: J4.93

Not connected (* = marked no-connect by the designer): J3 1 2* 3 4* 5 6* 7 8* 9 10* 11 12* 13 14* 15 16* 17 18* 19 20* 21 22* 23 24* 25 26* 27 29 31 33 35 37 39 41; J4 98 99 100 101 102 103 104 105 106 107 108 109 110 111 112 113 114 115 116 117 118 119 120 121 122 123 124 125 126 127 128 129 130 131 132 133 134 135 136 137 138 139 140

### Buses and harness runs
bus DIFF_N[1..64] = port IN_N[1..64]
bus DIFF_P[1..64] = port IN_P[1..64]

### Layout directives
differential pair: DIFF_N1, DIFF_N2, DIFF_N3, DIFF_N4, DIFF_N5, DIFF_N6, DIFF_N7, DIFF_N8, DIFF_N9, DIFF_N10, DIFF_N11, DIFF_N12, DIFF_N13, DIFF_N14, DIFF_N15, DIFF_N16, DIFF_N17, DIFF_N18, DIFF_N19, DIFF_N20, DIFF_N21, DIFF_N22, DIFF_N23, DIFF_N24, DIFF_N25, DIFF_N26, DIFF_N27, DIFF_N28, DIFF_N29, DIFF_N30, DIFF_N31, DIFF_N32, DIFF_N33, DIFF_N34, DIFF_N35, DIFF_N36, DIFF_N37, DIFF_N38, DIFF_N39, DIFF_N40, DIFF_N41, DIFF_N42, DIFF_N43, DIFF_N44, DIFF_N45, DIFF_N46, DIFF_N47, DIFF_N48, DIFF_N49, DIFF_N50, DIFF_N51, DIFF_N52, DIFF_N53, DIFF_N54, DIFF_N55, DIFF_N56, DIFF_N57, DIFF_N58, DIFF_N59, DIFF_N60, DIFF_N61, DIFF_N62, DIFF_N63, DIFF_N64, DIFF_P1, DIFF_P2, DIFF_P3, DIFF_P4, DIFF_P5, DIFF_P6, DIFF_P7, DIFF_P8, DIFF_P9, DIFF_P10, DIFF_P11, DIFF_P12, DIFF_P13, DIFF_P14, DIFF_P15, DIFF_P16, DIFF_P17, DIFF_P18, DIFF_P19, DIFF_P20, DIFF_P21, DIFF_P22, DIFF_P23, DIFF_P24, DIFF_P25, DIFF_P26, DIFF_P27, DIFF_P28, DIFF_P29, DIFF_P30, DIFF_P31, DIFF_P32, DIFF_P33, DIFF_P34, DIFF_P35, DIFF_P36, DIFF_P37, DIFF_P38, DIFF_P39, DIFF_P40, DIFF_P41, DIFF_P42, DIFF_P43, DIFF_P44, DIFF_P45, DIFF_P46, DIFF_P47, DIFF_P48, DIFF_P49, DIFF_P50, DIFF_P51, DIFF_P52, DIFF_P53, DIFF_P54, DIFF_P55, DIFF_P56, DIFF_P57, DIFF_P58, DIFF_P59, DIFF_P60, DIFF_P61, DIFF_P62, DIFF_P63, DIFF_P64

### Library data of the parts
J3 J4 = ERM8-070-01-L-D-RA: Name: ERM8-070-01-L-D-RA; Manufacturer: Samtec